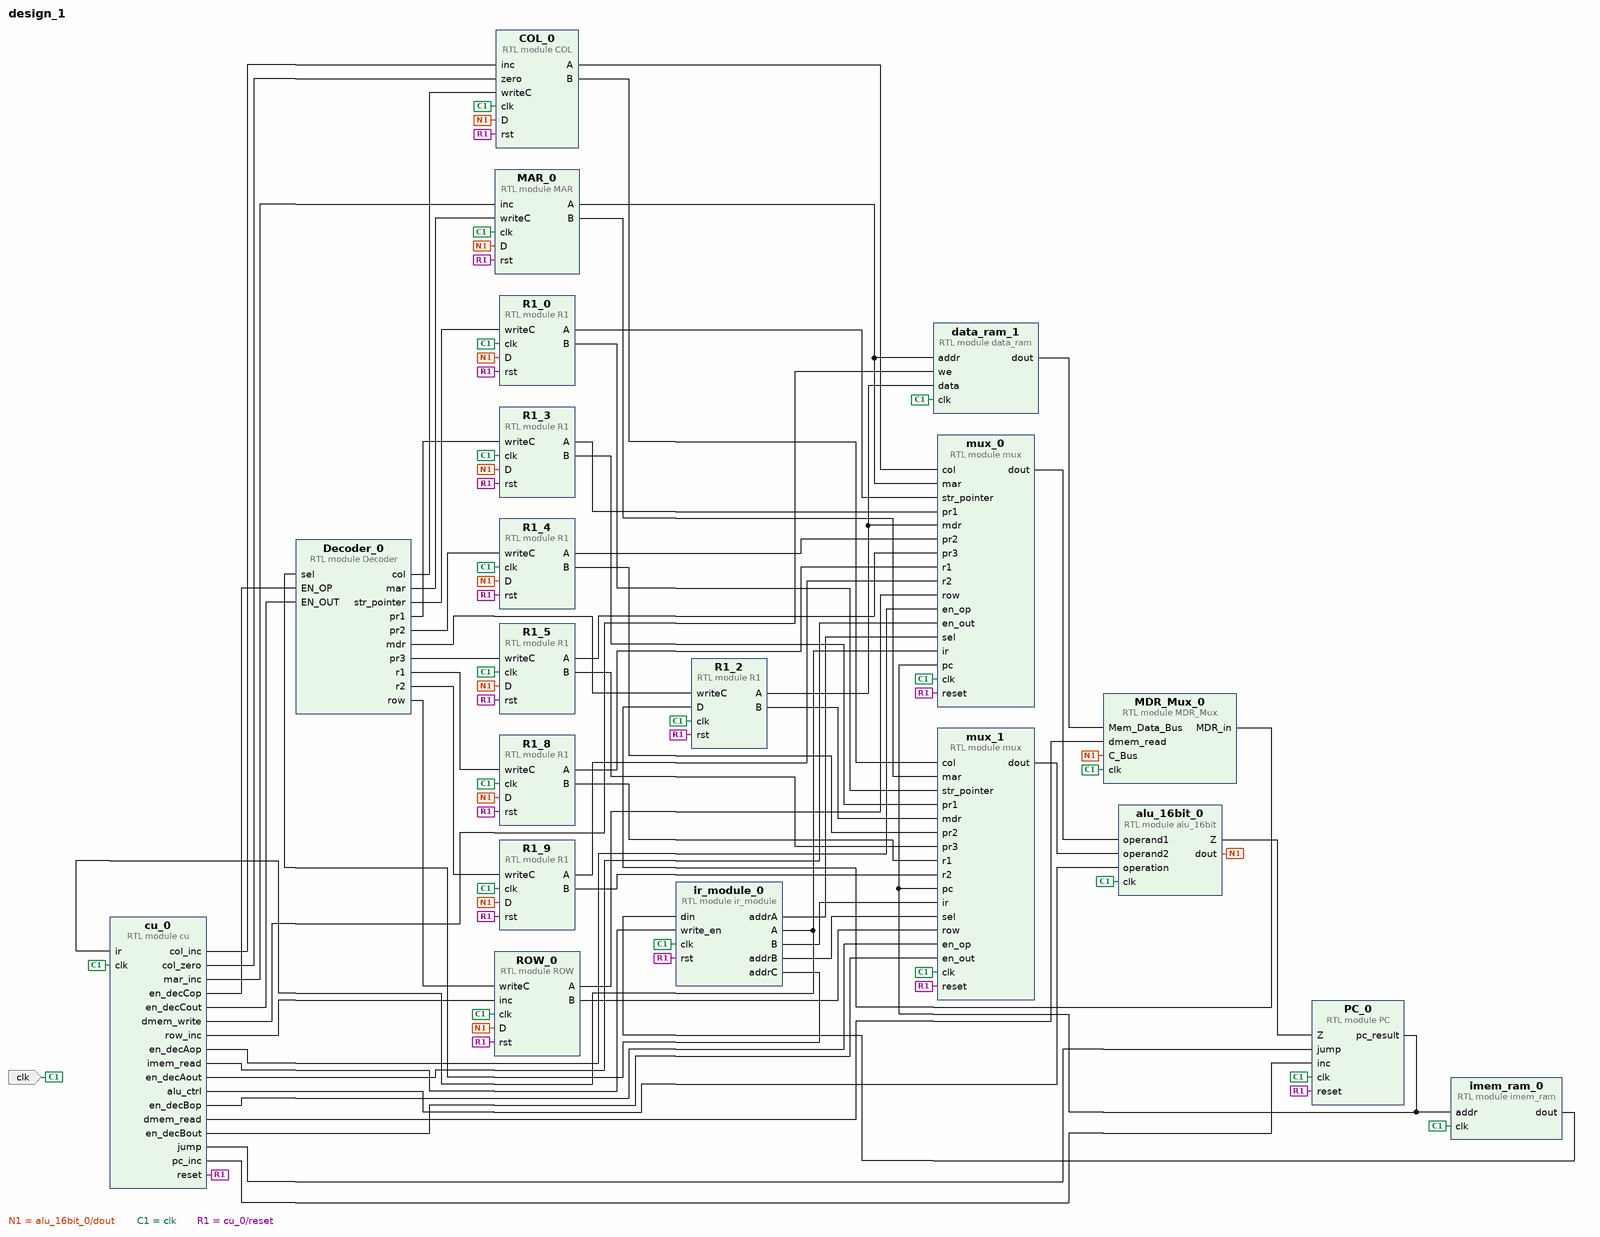
[diagram p0: block diagram of the top level]
# Vivado block design design_1, xc7z020clg484-1, Vivado 2021.2
create_bd_design design_1

create_bd_port -dir I -type clk clk
set_property -dict {CONFIG.FREQ_HZ 100000000} [get_bd_ports clk]

create_bd_cell -type module -reference R1 R1_0
create_bd_cell -type module -reference R1 R1_2
create_bd_cell -type module -reference R1 R1_3
create_bd_cell -type module -reference R1 R1_4
create_bd_cell -type module -reference R1 R1_5
create_bd_cell -type module -reference R1 R1_8
create_bd_cell -type module -reference R1 R1_9
create_bd_cell -type module -reference MAR MAR_0
create_bd_cell -type module -reference PC PC_0
create_bd_cell -type module -reference ir_module ir_module_0
create_bd_cell -type module -reference cu cu_0
create_bd_cell -type module -reference ROW ROW_0
create_bd_cell -type module -reference COL COL_0
create_bd_cell -type module -reference MDR_Mux MDR_Mux_0
create_bd_cell -type module -reference Decoder Decoder_0
create_bd_cell -type module -reference mux mux_0
create_bd_cell -type module -reference mux mux_1
create_bd_cell -type module -reference alu_16bit alu_16bit_0
create_bd_cell -type module -reference data_ram data_ram_1
create_bd_cell -type module -reference imem_ram imem_ram_0

# ---- connections ----

connect_bd_net [get_bd_pins COL_0/A] [get_bd_pins mux_0/col]
connect_bd_net [get_bd_pins COL_0/B] [get_bd_pins mux_1/col]
connect_bd_net [get_bd_pins Decoder_0/col] [get_bd_pins COL_0/writeC]
connect_bd_net [get_bd_pins Decoder_0/mar] [get_bd_pins MAR_0/writeC]
connect_bd_net [get_bd_pins Decoder_0/mdr] [get_bd_pins R1_2/writeC]
connect_bd_net [get_bd_pins Decoder_0/pr1] [get_bd_pins R1_3/writeC]
connect_bd_net [get_bd_pins Decoder_0/pr2] [get_bd_pins R1_4/writeC]
connect_bd_net [get_bd_pins Decoder_0/pr3] [get_bd_pins R1_5/writeC]
connect_bd_net [get_bd_pins Decoder_0/r1] [get_bd_pins R1_8/writeC]
connect_bd_net [get_bd_pins Decoder_0/r2] [get_bd_pins R1_9/writeC]
connect_bd_net [get_bd_pins Decoder_0/row] [get_bd_pins ROW_0/writeC]
connect_bd_net [get_bd_pins Decoder_0/str_pointer] [get_bd_pins R1_0/writeC]
connect_bd_net [get_bd_pins MAR_0/A] [get_bd_pins mux_0/mar] [get_bd_pins data_ram_1/addr]
connect_bd_net [get_bd_pins MAR_0/B] [get_bd_pins mux_1/mar]
connect_bd_net [get_bd_pins MDR_Mux_0/MDR_in] [get_bd_pins R1_2/D]
connect_bd_net [get_bd_pins R1_0/A] [get_bd_pins mux_0/str_pointer]
connect_bd_net [get_bd_pins R1_0/B] [get_bd_pins mux_1/str_pointer]
connect_bd_net [get_bd_pins R1_2/A] [get_bd_pins mux_0/mdr] [get_bd_pins data_ram_1/data]
connect_bd_net [get_bd_pins R1_2/B] [get_bd_pins mux_1/mdr]
connect_bd_net [get_bd_pins R1_3/A] [get_bd_pins mux_0/pr1]
connect_bd_net [get_bd_pins R1_3/B] [get_bd_pins mux_1/pr1]
connect_bd_net [get_bd_pins R1_4/A] [get_bd_pins mux_0/pr2]
connect_bd_net [get_bd_pins R1_4/B] [get_bd_pins mux_1/pr2]
connect_bd_net [get_bd_pins R1_5/A] [get_bd_pins mux_0/pr3]
connect_bd_net [get_bd_pins R1_5/B] [get_bd_pins mux_1/pr3]
connect_bd_net [get_bd_pins R1_8/A] [get_bd_pins mux_0/r1]
connect_bd_net [get_bd_pins R1_8/B] [get_bd_pins mux_1/r1]
connect_bd_net [get_bd_pins R1_9/A] [get_bd_pins mux_0/r2]
connect_bd_net [get_bd_pins R1_9/B] [get_bd_pins mux_1/r2]
connect_bd_net [get_bd_pins ROW_0/A] [get_bd_pins mux_0/row]
connect_bd_net [get_bd_pins ROW_0/B] [get_bd_pins mux_1/row]
connect_bd_net [get_bd_pins alu_16bit_0/Z] [get_bd_pins PC_0/Z]
connect_bd_net -net alu_16bit_0_out [get_bd_pins alu_16bit_0/dout] \
  [get_bd_pins R1_9/D] [get_bd_pins R1_8/D] [get_bd_pins R1_5/D] [get_bd_pins R1_4/D] [get_bd_pins R1_3/D] \
  [get_bd_pins MAR_0/D] [get_bd_pins R1_0/D] [get_bd_pins COL_0/D] [get_bd_pins ROW_0/D] [get_bd_pins MDR_Mux_0/C_Bus]
connect_bd_net -net clockgen_0_clk [get_bd_ports clk] \
  [get_bd_pins R1_0/clk] [get_bd_pins PC_0/clk] [get_bd_pins ir_module_0/clk] [get_bd_pins MAR_0/clk] [get_bd_pins R1_2/clk] \
  [get_bd_pins R1_3/clk] [get_bd_pins R1_4/clk] [get_bd_pins R1_5/clk] [get_bd_pins R1_9/clk] [get_bd_pins R1_8/clk] \
  [get_bd_pins cu_0/clk] [get_bd_pins COL_0/clk] [get_bd_pins ROW_0/clk] [get_bd_pins MDR_Mux_0/clk] [get_bd_pins mux_0/clk] \
  [get_bd_pins mux_1/clk] [get_bd_pins alu_16bit_0/clk] [get_bd_pins data_ram_1/clk] [get_bd_pins imem_ram_0/clk]
connect_bd_net [get_bd_pins cu_0/alu_ctrl] [get_bd_pins alu_16bit_0/operation]
connect_bd_net [get_bd_pins cu_0/col_inc] [get_bd_pins COL_0/inc]
connect_bd_net [get_bd_pins cu_0/col_zero] [get_bd_pins COL_0/zero]
connect_bd_net [get_bd_pins cu_0/dmem_read] [get_bd_pins MDR_Mux_0/dmem_read]
connect_bd_net [get_bd_pins cu_0/dmem_write] [get_bd_pins data_ram_1/we]
connect_bd_net [get_bd_pins cu_0/en_decAop] [get_bd_pins mux_0/en_op]
connect_bd_net [get_bd_pins cu_0/en_decAout] [get_bd_pins mux_0/en_out]
connect_bd_net [get_bd_pins cu_0/en_decBop] [get_bd_pins mux_1/en_op]
connect_bd_net [get_bd_pins cu_0/en_decBout] [get_bd_pins mux_1/en_out]
connect_bd_net [get_bd_pins cu_0/en_decCop] [get_bd_pins Decoder_0/EN_OP]
connect_bd_net [get_bd_pins cu_0/en_decCout] [get_bd_pins Decoder_0/EN_OUT]
connect_bd_net [get_bd_pins cu_0/imem_read] [get_bd_pins ir_module_0/write_en]
connect_bd_net [get_bd_pins cu_0/jump] [get_bd_pins PC_0/jump]
connect_bd_net [get_bd_pins cu_0/mar_inc] [get_bd_pins MAR_0/inc]
connect_bd_net [get_bd_pins cu_0/pc_inc] [get_bd_pins PC_0/inc]
connect_bd_net [get_bd_pins cu_0/reset] \
  [get_bd_pins R1_0/rst] [get_bd_pins PC_0/reset] [get_bd_pins ir_module_0/rst] [get_bd_pins MAR_0/rst] \
  [get_bd_pins R1_2/rst] [get_bd_pins R1_3/rst] [get_bd_pins R1_4/rst] [get_bd_pins R1_5/rst] [get_bd_pins R1_8/rst] \
  [get_bd_pins R1_9/rst] [get_bd_pins ROW_0/rst] [get_bd_pins COL_0/rst] [get_bd_pins mux_0/reset] [get_bd_pins mux_1/reset]
connect_bd_net [get_bd_pins cu_0/row_inc] [get_bd_pins ROW_0/inc]
connect_bd_net [get_bd_pins data_ram_1/dout] [get_bd_pins MDR_Mux_0/Mem_Data_Bus]
connect_bd_net [get_bd_pins imem_ram_0/dout] [get_bd_pins ir_module_0/din]
connect_bd_net [get_bd_pins ir_module_0/A] [get_bd_pins cu_0/ir] [get_bd_pins mux_0/ir]
connect_bd_net [get_bd_pins ir_module_0/B] [get_bd_pins mux_1/ir]
connect_bd_net [get_bd_pins ir_module_0/addrA] [get_bd_pins mux_0/sel]
connect_bd_net [get_bd_pins ir_module_0/addrB] [get_bd_pins mux_1/sel]
connect_bd_net [get_bd_pins ir_module_0/addrC] [get_bd_pins Decoder_0/sel]
connect_bd_net -net mux_0_out [get_bd_pins mux_0/dout] [get_bd_pins alu_16bit_0/operand1]
connect_bd_net -net mux_1_out [get_bd_pins mux_1/dout] [get_bd_pins alu_16bit_0/operand2]
connect_bd_net -net pc_project_demo_1_PCResult [get_bd_pins PC_0/pc_result] \
  [get_bd_pins mux_0/pc] [get_bd_pins mux_1/pc] [get_bd_pins imem_ram_0/addr]

set_property USER_COMMENTS.comment_0 STR_POINTER [current_bd_design]
set_property USER_COMMENTS.comment_1 PC [current_bd_design]
set_property USER_COMMENTS.comment_2 IR [current_bd_design]
set_property USER_COMMENTS.comment_5 PR1 [current_bd_design]
set_property USER_COMMENTS.comment_6 PR2 [current_bd_design]
set_property USER_COMMENTS.comment_7 PR3 [current_bd_design]
set_property USER_COMMENTS.comment_8 ROW [current_bd_design]
set_property USER_COMMENTS.comment_9 COL [current_bd_design]
set_property USER_COMMENTS.comment_10 R1 [current_bd_design]
set_property USER_COMMENTS.comment_11 R2 [current_bd_design]
set_property USER_COMMENTS.comment_4 MDR [get_bd_cells /R1_2]

validate_bd_design
save_bd_design
